# Altium project DAL_IRL_V10.PrjPcb
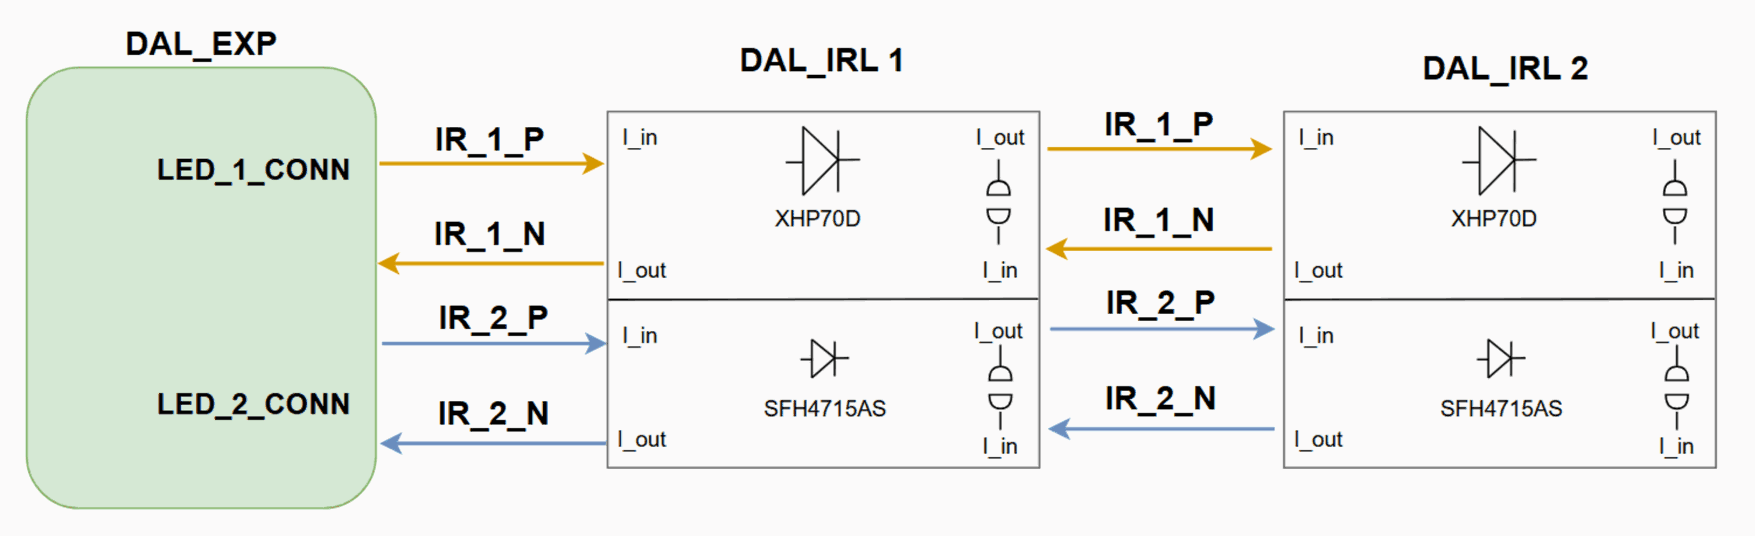
[diagram p0: BlockDiagram.SchDoc]
=Revision: 1.0.0; ApprovedBy: Vu Pham; CheckedBy: Bao Bui; MasterProject: BEE-DAL; ProjectName: IRL
4 sheets, 14 parts. Net scope: global (net labels, ports and power ports of the same name join across sheets).
Board file: DAL_IRL.PcbDoc
Sheets:
  CoverPage.SchDoc
  Index.SchDoc
  BlockDiagram.SchDoc
  Sheet1.SchDoc

## Sheet CoverPage.SchDoc
size 420 x 297 mm; SheetNumber: 1; SheetTotal: 4

### Notes on the sheet
- Project
- Sub-system:
- Design by:
- Sheet title:
- Sheet:
- of
- Checked by:
- Approved by:
- Doc no:
- Revision
- Size:
- Date:

## Sheet Index.SchDoc
size 420 x 297 mm; SheetNumber: 2; SheetTotal: 4

### Notes on the sheet
- Project
- Sub-system:
- Design by:
- Sheet title:
- Sheet:
- of
- Checked by:
- Approved by:
- Doc no:
- Revision
- Size:
- Date:

## Sheet BlockDiagram.SchDoc
size 420 x 297 mm; SheetNumber: 3; SheetTotal: 4

### Notes on the sheet
- Project
- Sub-system:
- Design by:
- Sheet title:
- Sheet:
- of
- Checked by:
- Approved by:
- Doc no:
- Revision
- Size:
- Date:

## Sheet Sheet1.SchDoc
size 420 x 297 mm; SheetNumber: 4; SheetTotal: 4
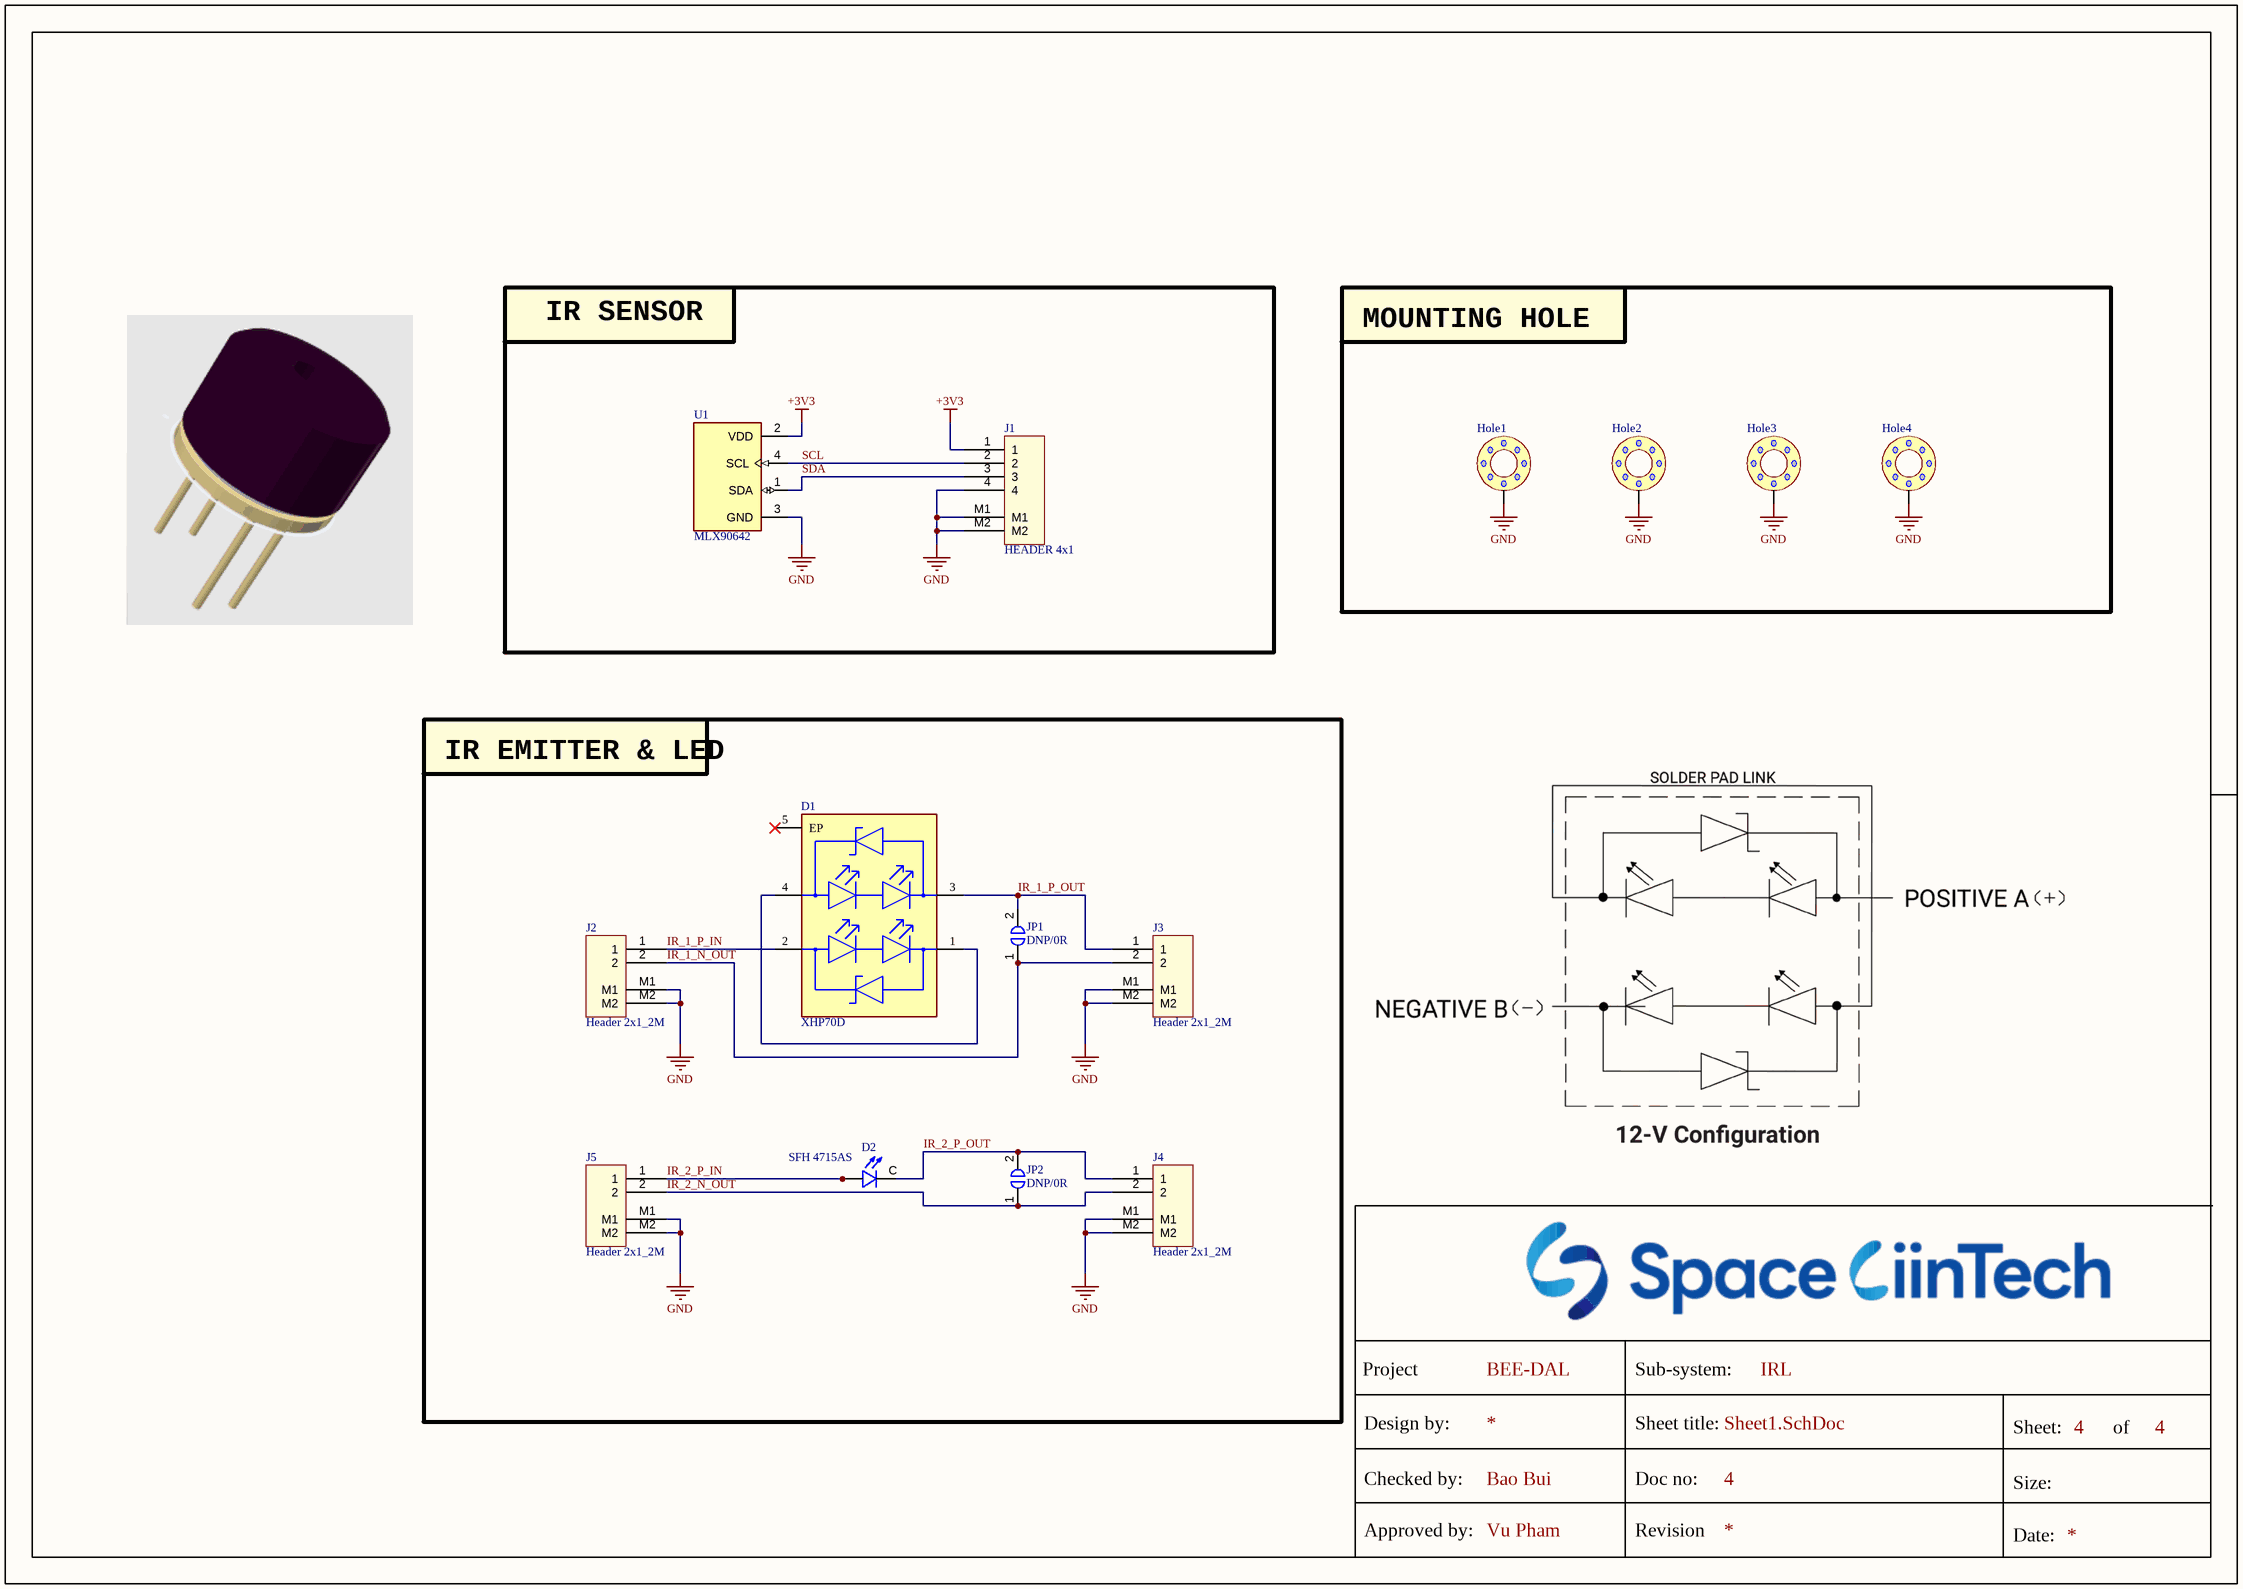
[diagram p1: Sheet1.SchDoc]

### Parts
D1  XHP70D  [XHP70.3 High Intensity]
D2  SFH 4715AS  [SFH 4715AS]
Hole1  hole_space  [HEX-M3_NoVia]  (value not drawn)
Hole2  hole_space  [HEX-M3_NoVia]  (value not drawn)
Hole3  hole_space  [HEX-M3_NoVia]  (value not drawn)
Hole4  hole_space  [HEX-M3_NoVia]  (value not drawn)
J1  HEADER 4x1  [MOLEX_0532610471]
J2  Header 2x1_2M  [MOLEX_0532610271]
J3  Header 2x1_2M  [MOLEX_0532610271]
J4  Header 2x1_2M  [MOLEX_0532610271]
J5  Header 2x1_2M  [MOLEX_0532610271]
JP1  DNP/0R  [RES_C_1608X60]
JP2  DNP/0R  [RES_C_1608X60]
U1  MLX90642  [TO39 package]

### Blocks framed on the sheet
IR SENSOR: J1 U1
MOUNTING HOLE: Hole1-Hole4
IR EMITTER & LED: D1 D2 J2-J5 JP1 JP2

### Nets
+3V3: J1.1 U1.2(VDD)
GND: Hole1.1 Hole2.1 Hole3.1 Hole4.1 J1.4 J1.M1 J1.M2 J2.M1 J2.M2 J3.M1 J3.M2 J4.M1 J4.M2 J5.M1 J5.M2 U1.3(GND)
IR_1_N_OUT: J2.2 J3.2 JP1.1
IR_1_P_IN: D1.2(1_ANODE) J2.1
IR_1_P_OUT: D1.3(2_CATHODE) J3.1 JP1.2
IR_2_N_OUT: J4.2 J5.2 JP2.1
IR_2_P_IN: D2.A1(A) D2.A2(A) J5.1
IR_2_P_OUT: D2.C J4.1 JP2.2
SCL: J1.2 U1.4(SCL)
SDA: J1.3 U1.1(SDA)
NetD1_1: D1.1(1_CATHODE) D1.4(2_ANODE)

Not connected (* = marked no-connect by the designer): D1 5(EP)*

### Notes on the sheet
- Project
- Sub-system:
- Design by:
- Sheet title:
- Sheet:
- of
- Checked by:
- Approved by:
- Doc no:
- Revision
- Size:
- Date:

### Library data of the parts
D1 = XHP70D: LED Lighting XLamp® XHP70.3 White, Cool 5000K 11.2V 1.05A 120° 2828
D2 = SFH 4715AS: Infrared (IR) Emitter 860nm 3.2V 1.5A
J1 = Header 4x1_2M
JP1 JP2 = JUMPER_1_1
U1 = MLX90642: 32X24 THERMAL ARRAY, 110DEG FOV